# Altium schematic sheet VOLTAGE_SOURCE.SchDoc: Tecotec GYT Tx
size A4; DrawnBy: Nhatkhongbuon; SheetNumber: 1; SheetTotal: 4
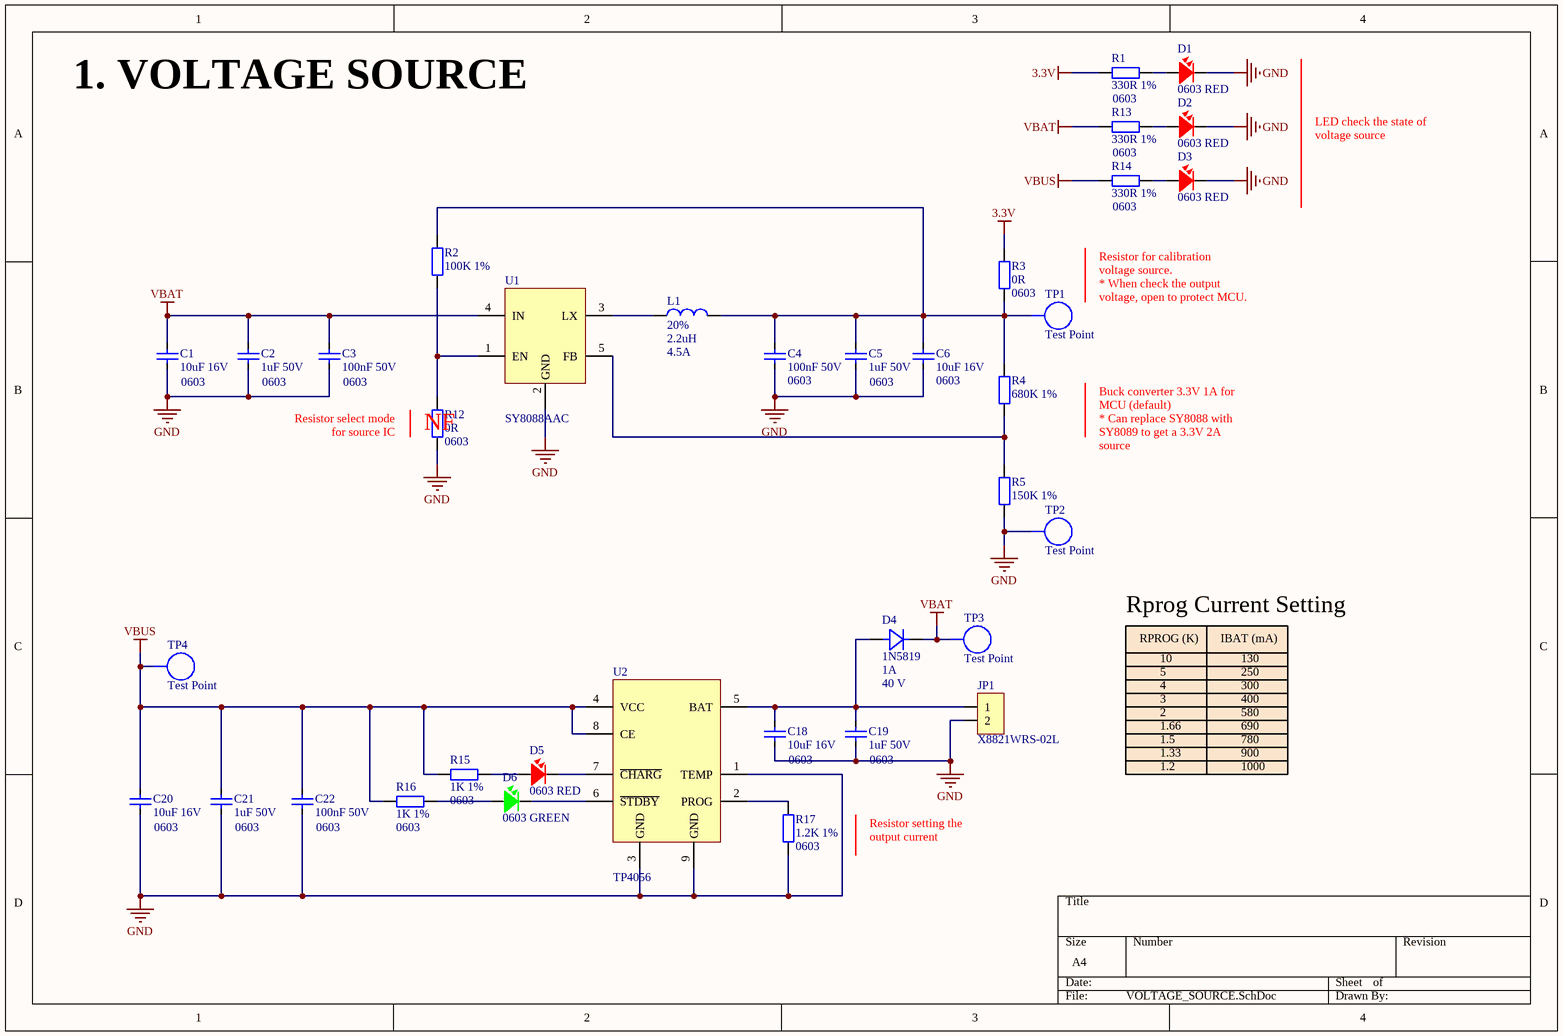
[diagram p0: VOLTAGE_SOURCE.SchDoc]

## Parts
C1  10uF 16V  Size: 0603  [CAP_SMD_0603]
C2  1uF 50V  Size: 0603  [CAP_SMD_0603]
C3  100nF 50V  Size: 0603  [CAP_SMD_0603]
C4  100nF 50V  Size: 0603  [CAP_SMD_0603]
C5  1uF 50V  Size: 0603  [CAP_SMD_0603]
C6  10uF 16V  Size: 0603  [CAP_SMD_0603]
C18  10uF 16V  Size: 0603  [CAP_SMD_0603]
C19  1uF 50V  Size: 0603  [CAP_SMD_0603]
C20  10uF 16V  Size: 0603  [CAP_SMD_0603]
C21  1uF 50V  Size: 0603  [CAP_SMD_0603]
C22  100nF 50V  Size: 0603  [CAP_SMD_0603]
D1  0603 RED  [LED-0603]
D2  0603 RED  [LED-0603]
D3  0603 RED  [LED-0603]
D4  1N5819  Current - Average Rectified (Io): 1A  Voltage - DC Reverse (Vr) (Max): 40 V  [DIO-SMD-123]
D5  0603 RED  [LED-0603]
D6  0603 GREEN  [LED-0603]
JP1  X8821WRS-02L  [CONN_X8821WRS-02L-LPSN]
L1  Tolerance: 20%  Inductor: 2.2uH  Current: 4.5A  [L0420]  (hidden comment: 2.2uH 4.5A 20%)
R1  330R 1%  Size: 0603  [RES_SMD_0603]
R2  100K 1%  [RES_SMD_0603]
R3  0R  Size: 0603  [RES_SMD_0603]
R4  680K 1%  [RES_SMD_0603]
R5  150K 1%  [RES_SMD_0603]
R12  0R  Size: 0603  [RES_SMD_0603]
R13  330R 1%  Size: 0603  [RES_SMD_0603]
R14  330R 1%  Size: 0603  [RES_SMD_0603]
R15  1K 1%  Size: 0603  [RES_SMD_0603]
R16  1K 1%  Size: 0603  [RES_SMD_0603]
R17  1.2K 1%  Size: 0603  [RES_SMD_0603]
TP1  Test Point  [TEST_POINT]
TP2  Test Point  [TEST_POINT]
TP3  Test Point  [TEST_POINT]
TP4  Test Point  [TEST_POINT]
U1  SY8088AAC  [SOT23_5]
U2  TP4056  [ESOP-8]

## Nets
3.3V: R1.1 R3.2
GND: C1.1 C2.1 C3.1 C4.1 C5.1 C6.1 C18.1 C19.1 C20.1 C21.1 C22.1 D1.2 D2.2 D3.2 JP1.2 R5.1 R12.1 R17.1 TP2.1 U1.2(GND) U2.1(TEMP) U2.3(GND) U2.9(GND)
VBAT: C1.2 C2.2 C3.2 D4.C R13.1 TP3.1 U1.4(IN)
VBUS: C20.2 C21.2 C22.2 R14.1 R15.2 R16.2 TP4.1 U2.4(VCC) U2.8(CE)
NetC4_2: C4.2 C5.2 C6.2 L1.2 R2.2 R3.1 R4.2 TP1.1
NetC18_2: C18.2 C19.2 D4.A JP1.1 U2.5(BAT)
NetD1_1: D1.1 R1.2
NetD2_1: D2.1 R13.2
NetD3_1: D3.1 R14.2
NetD5_1: D5.1 R15.1
NetD5_2: D5.2 U2.7(~{CHARG})
NetD6_1: D6.1 R16.1
NetD6_2: D6.2 U2.6(~{STDBY})
NetL1_1: L1.1 U1.3(LX)
NetR2_1: R2.1 R12.2 U1.1(EN)
NetR4_1: R4.1 R5.2 U1.5(FB)
NetR17_2: R17.2 U2.2(PROG)

## Notes on the sheet
- 1. VOLTAGE SOURCE
- LED check the state of voltage source
- Resistor for calibration voltage source.
  * When check the output voltage, open to protect MCU.
- Resistor select mode for source IC
- (near R12) NF
- Buck converter 3.3V 1A for MCU (default)
  * Can replace SY8088 with SY8089 to get a 3.3V 2A source
- Rprog Current Setting
- RPROG (K)
- IBAT (mA)
- 10
- 2
- 3
- 4
- 5
- 130
- 250
- 300
- 400
- 580
- 1.66
- 1.5
- 1.33
- 1.2
- 690
- 780
- 900
- 1000
- Resistor setting the output current

## Library data of the parts
C1 C6 C18 C20 = C0603_MLCC_10uF_16V: 10 µF ±20% 16V Ceramic Capacitor X6S 0603 (1608 Metric); Manufacturer: Murata Electronics; Manufacture Part Number: GRM188C81C106MA73D; Packaging: Cut Tape (CT); Link: https://www.digikey.cn/en/products/detail/murata-electronics/GRM188C81C106MA73D/3900463; Price: $0.25
C2 C5 C19 C21 = C0603_MLCC_1uF_50V: 1 µF ±10% 50V Ceramic Capacitor X5R 0603 (1608 Metric); Manufacturer: Samsung Electro-Mechanics; Manufacture Part Number: CL10A105KB8NNNC; Packaging: Cut Tape (CT); Link: https://www.digikey.cn/en/products/detail/samsung-electro-mechanics/CL10A105KB8NNNC/3887518; Price: $0.14
C3 C4 C22 = C0603_MLCC_100nF_50V: 0.1 µF ±10% 50V Ceramic Capacitor X7R 0603 (1608 Metric); Manufacturer: Samsung Electro-Mechanics; Manufacture Part Number: CL10B104KB8NNNC; Packaging: Cut Tape (CT); Link: https://www.digikey.cn/en/products/detail/samsung-electro-mechanics/CL10B104KB8NNNC/3886658; Price: $0.10
D1-D3 D5 = LED_0603_RED: Red 625nm LED Indication - Discrete 2V 0603 (1608 Metric); Manufacturer: Würth Elektronik; Manufacture Part Number: 150060RS75000; Packaging: Cut Tape (CT); Link: https://www.digikey.cn/en/products/detail/w%C3%BCrth-elektronik/150060RS75000/4489901; Price: $0.15
D4 = 1N5819: Diode 40 V 1A Surface Mount SOD-123; Manufacturer: Diodes Incorporated; Manufacture Part Number: 1N5819HW-7-F; Voltage - Forward (Vf) (Max) @ If: 450 mV @ 1 A; Capacitance @ Vr, F: 60pF @ 4V, 1MHz; Packaging: Cut Tape (CT); Link: https://www.digikey.cn/en/products/detail/diodes-incorporated/1N5819HW-7-F/814970; Price: $0.43; Operating Temperature - Junction: -65°C ~ 125°C
D6 = LED_0603_GREEN: Green 520nm LED Indication - Discrete 3.2V 0603 (1608 Metric); Manufacturer: Würth Elektronik; Manufacture Part Number: 150060GS75000; Packaging: Cut Tape (CT); Link: https://www.digikey.cn/en/products/detail/w%C3%BCrth-elektronik/150060GS75000/4489898; Price: $0.15
JP1 = X8821WRS-02L: 1x2P 2P 1 Tin 2.5mm 2 Brass 2A Surface Mount，Right Angle SMD,P=2.5mm,Surface Mount，Right Angle Wire To Board Connector ROHS; Manufacturer: XKB Connection; Manufacture Part Number: X8821WRS-02L-LPSN; Link: https://www.lcsc.com/product-detail/Wire-To-Board-Connector_XKB-Connection-X8821WRS-02L-LPSN_C519150.html; Price: $ 0.0852
L1 = L_0420_2.2uH_4.5A: 4.5A 2.2uH Molding Choke ±20% 5A SMD,0420 Power Inductors ROHS; Manufacturer: XR; Manufacture Part Number: XR0420-2R2M; Link: https://www.lcsc.com/product-detail/Power-Inductors_XR-XR0420-2R2M_C5307589.html; Price: $ 0.0661
R1 R13 R14 = R0603_330R: 330 Ohms ±1% 0.1W, 1/10W Chip Resistor 0603 (1608 Metric) Thick Film; Manufacturer: TE Connectivity Passive Product; Manufacture Part Number: CRG0603F330R; Packaging: Cut Tape (CT); Link: https://www.digikey.cn/en/products/detail/te-connectivity-passive-product/CRG0603F330R/2380765; Price: $0.10
R2 = R0603_100K: 100 kOhms ±1% 0.1W, 1/10W Chip Resistor 0603 (1608 Metric) Moisture Resistant Thick Film; Manufacturer: YAGEO; Manufacture Part Number: RC0603FR-07100KL; Packaging: Cut Tape (CT); Link: https://www.digikey.cn/en/products/detail/yageo/RC0603FR-07100KL/726889; Price: $0.10; Size: 0603
R3 R12 = R0603_0R: 0 Ohms Jumper Chip Resistor 0603 (1608 Metric) Automotive AEC-Q200 Thick Film; Manufacturer: Stackpole Electronics Inc; Manufacture Part Number: RMCF0603ZT0R00; Packaging: Cut Tape (CT); Link: https://www.digikey.cn/en/products/detail/stackpole-electronics-inc/RMCF0603ZT0R00/1756908; Price: $0.10
R4 = R0603_680K: 680 kOhms ±1% 0.1W, 1/10W Chip Resistor 0603 (1608 Metric) Moisture Resistant Thick Film; Manufacturer: YAGEO; Manufacture Part Number: RC0603FR-07680KL; Packaging: Cut Tape (CT); Link: https://www.digikey.cn/en/products/detail/yageo/RC0603FR-07680KL/727356; Price: $0.10; Size: 0603
R5 = R0603_150K: 150 kOhms ±1% 0.1W, 1/10W Chip Resistor 0603 (1608 Metric) Automotive AEC-Q200 Thick Film; Manufacturer: Vishay Dale; Manufacture Part Number: CRCW0603150KFKEA; Packaging: Cut Tape (CT); Link: https://www.digikey.cn/en/products/detail/vishay-dale/CRCW0603150KFKEA/1174914; Price: $0.10; Size: 0603
R15 R16 = R0603_1K: 1 kOhms ±1% 0.1W, 1/10W Chip Resistor 0603 (1608 Metric) Moisture Resistant Thick Film; Manufacturer: YAGEO; Manufacture Part Number: RC0603FR-071KL; Packaging: Cut Tape (CT); Link: https://www.digikey.cn/en/products/detail/yageo/RC0603FR-071KL/726843; Price: $0.10
R17 = R0603_1.2K: 1.2 kOhms ±1% 0.1W, 1/10W Chip Resistor 0603 (1608 Metric) Automotive AEC-Q200 Thick Film; Manufacturer: Stackpole Electronics Inc; Manufacture Part Number: RC0603FR-071KL; Packaging: Cut Tape (CT); Link: https://www.digikey.cn/en/products/detail/stackpole-electronics-inc/RMCF0603FT1K20/1761134; Price: $0.10
TP1-TP4 = TEST_POINT
U1 = SY8088AAC: Step-down type SOT-23-5 DC-DC Converters ROHS; Manufacturer: Silergy Corp; Manufacture Part Number: SY8088AAC; Link: https://www.lcsc.com/product-detail/DC-DC-Converters_Silergy-Corp-SY8088AAC_C79313.html; Price: $ 0.0865
U2 = TP4056: ESOP-8 Battery Management ICs ROHS; Manufacturer: UMW(Youtai Semiconductor Co., Ltd.); Manufacture Part Number: TP4056; Packaging: Cut Tape (CT); Link: https://www.lcsc.com/product-detail/Battery-Management-ICs_UMW-Youtai-Semiconductor-Co-Ltd-TP4056_C725790.html; Price: $ 0.0565